# EasyEDA Pro project ProPrj_FRC ESP32 CAN DevKit Lite_2025-11-01.epro, board PCB1
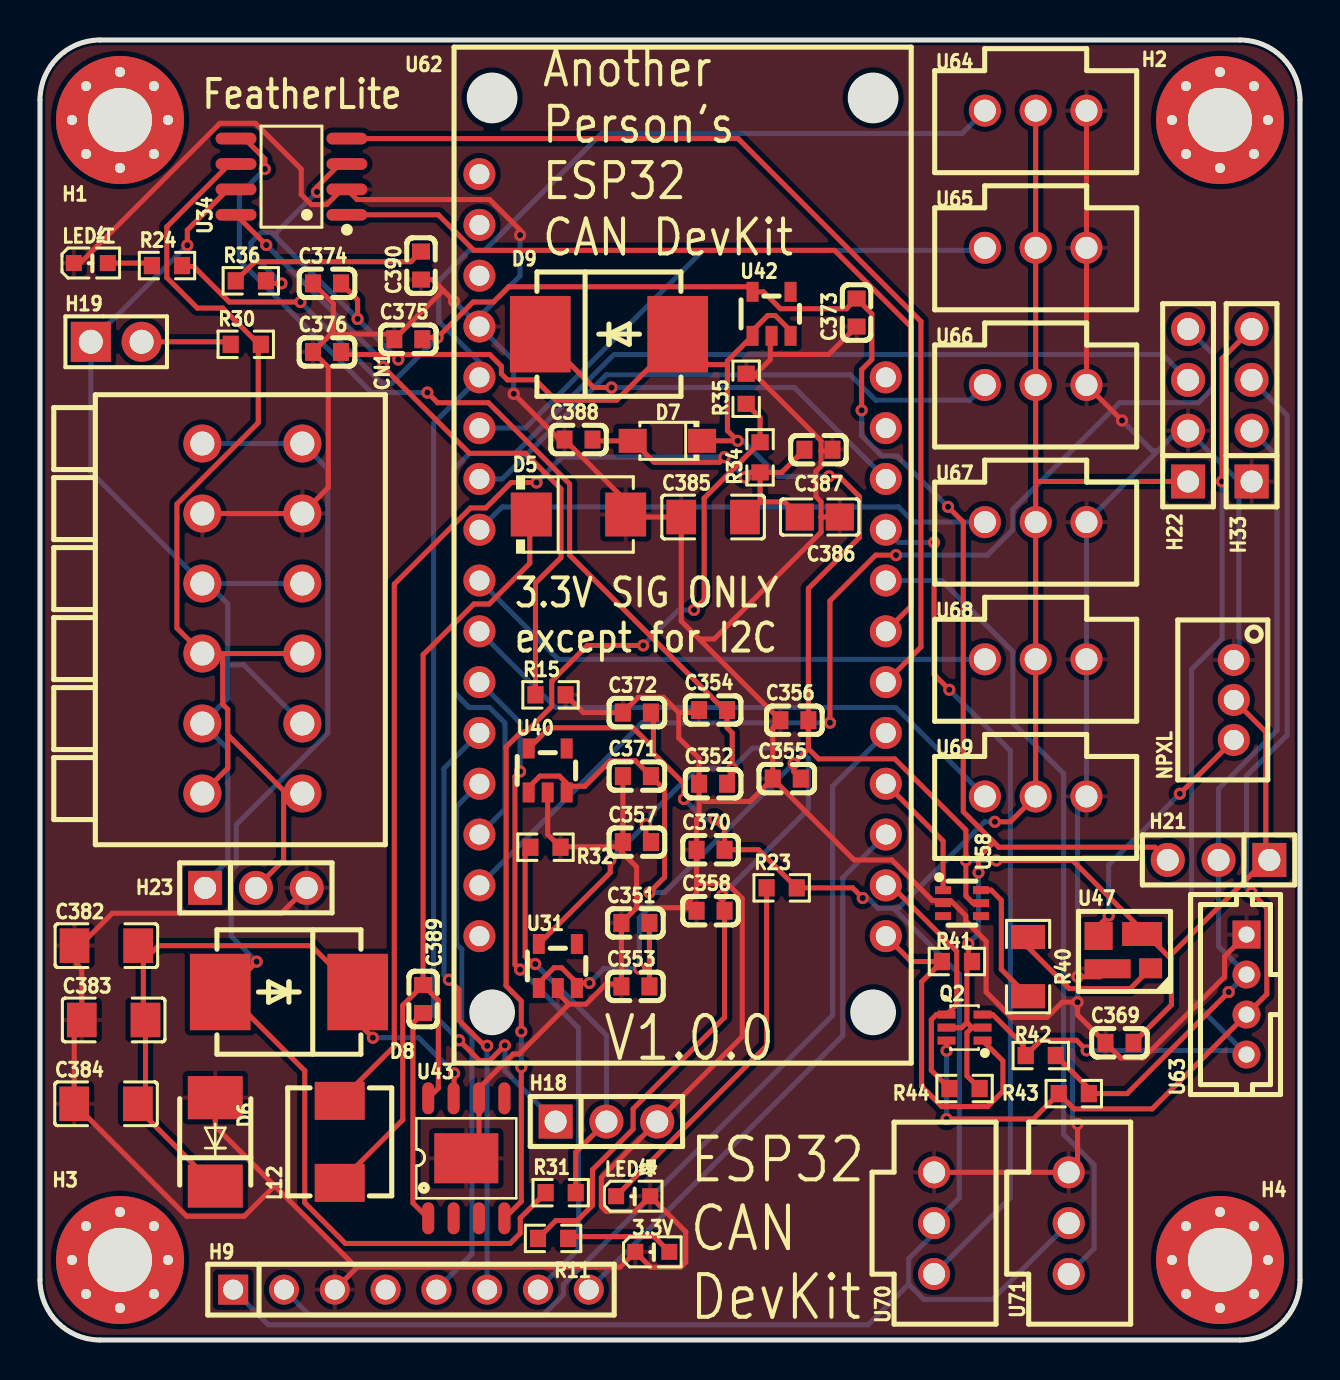
[diagram p1: board, top side]
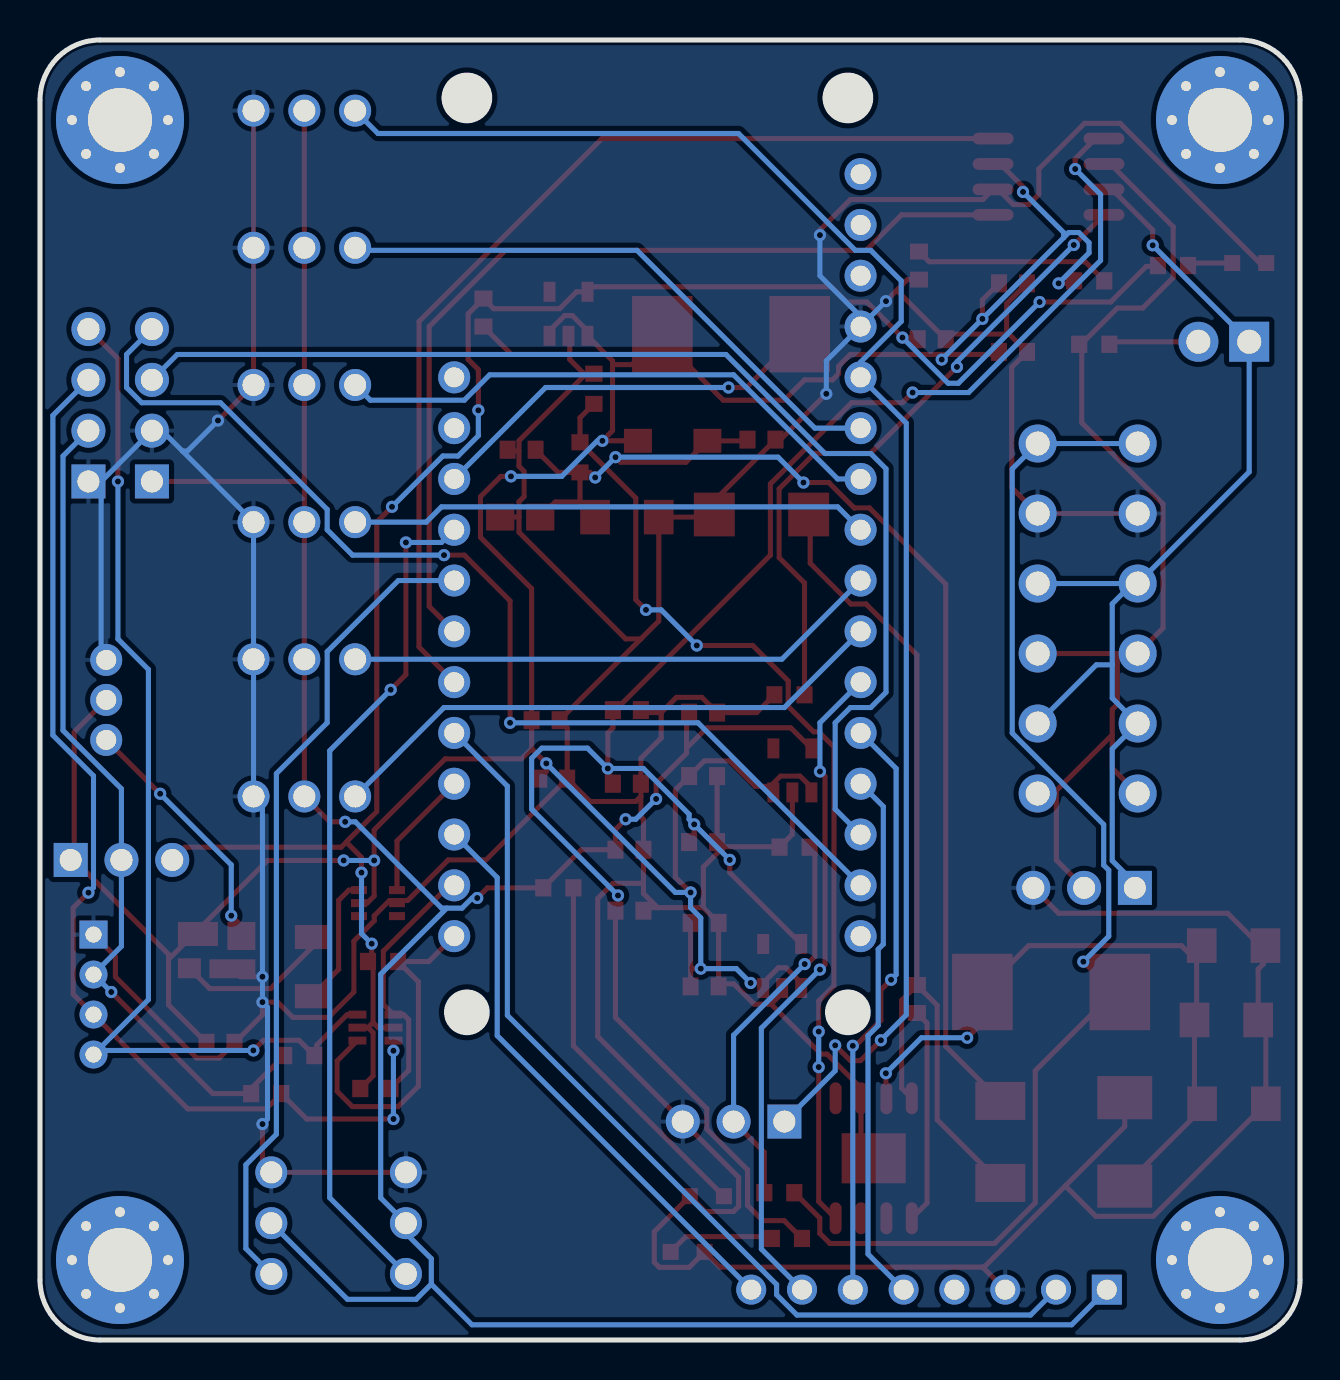
[diagram p2: board, bottom side, seen from below]

Outline 63 x 65 mm; copper layers: Top Layer, Bottom Layer. Coordinates in mm from the lower left corner of the outline.
Outline path: 0,62 0,3 arc(0.88,0.88) 3,0 60,0 arc(62.12,0.88) 63,3 63,62 arc(62.12,64.12) 60,65 3,65 arc(0.88,64.12) 0,62
Stack: Top Layer 0.035mm / Dielectric1 1.51mm FR4 er 4.5 / Bottom Layer 0.035mm

## Design rules (mm)
template: JLCPCB Capability(Two Layers Board)
spacing copperThickness1oz (default): track to track 0.102, other pairs 0.152 to 0.3
spacing copperThickness2oz: track to track 0.203, other pairs 0.152 to 0.3
track width copperThickness1oz (default): min 0.127, default 0.254, max 2.54
track width copperThickness2oz: min 0.203, default 0.254, max 2.54
differential pair differentialPair (default): width min 0.127, default 0.254, max 2.54; gap min 0.152, default 0.152
via viaSize (default): diameter min 0.5, default 0.61, max 10; hole min 0.3, default 0.305, max 6.3

## Placement (name value [footprint] x y rotation side)
3.3V  SZYY0603B  [LED0603-R-RD_BLUE]  30.61 4.44 0 top
C351  10uF  [C0603]  29.77 20.85 0 top
C352  10uF  [C0603]  33.66 27.81 0 top
C353  100nF  [C0603]  29.77 17.68 0 top
C354  100nF  [C0603]  33.66 31.5 0 top
C355  10uF  [C0603]  37.34 28.07 0 top
C356  100nF  [C0603]  37.72 30.99 0 top
C357  10uF  [C0603]  29.84 24.89 0 top
C358  100nF  [C0603]  33.53 21.46 0 top
C369  10uF  [C0603]  53.97 14.86 0 top
C370  10uF  [C0603]  33.53 24.51 0 top
C371  100nF  [C0603]  29.84 28.2 0 top
C372  100nF  [C0603]  29.84 31.37 0 top
C373  10uF  [C0603]  40.83 51.37 90 top
C374  100nF  [C0603]  14.35 52.83 0 top
C375  100nF  [C0603]  18.41 50.04 0 top
C376  10uF  [C0603]  14.35 49.4 0 top
C382  10uF  [C1206]  3.32 19.72 0 top
C383  22uF  [C1206]  3.68 16 0 top
C384  100nF  [C1206]  3.3 11.81 0 top
C385  47uF  [C1206]  33.66 41.15 0 top
C386  22uF  [C0805]  38.99 41.15 180 top
C387  10uF  [C0603]  38.92 44.51 180 top
C388  100nF  [C0603]  26.93 45.02 0 top
C389  100nF  [C0603]  19.16 17.05 270 top
C390  4.7uF  [C0603]  19.05 53.72 90 top
CN1  New_Library_2601-1106  [CONN-TH_2601-1106]  10.62 36.07 270 top
D5  SS54SMB  [SMB_L4.6-W3.6-LS5.3-RD]  26.92 41.28 0 top
D6  SMBJ28A  [SMB_L4.6-W3.6-LS5.3-L-FD]  8.76 9.91 270 top
D7  DSK34  [SOD-123FL_L2.7-W1.8-LS3.8-RD]  31.37 44.96 180 top
D8  MBRS540T3G  [SMC_L7.1-W6.2-LS8.1-RD]  12.45 17.4 180 top
D9  MBRS540T3G  [SMC_L7.1-W6.2-LS8.1-RD]  28.45 50.29 0 top
H1  Hole_Pad  [MountingHole:MountingHole_3.2mm_M3_Pad_Via]  4 61 0 top
H2  Hole_Pad  [MountingHole:MountingHole_3.2mm_M3_Pad_Via]  59 61 0 top
H3  Hole_Pad  [MountingHole:MountingHole_3.2mm_M3_Pad_Via]  4 4 0 top
H4  Hole_Pad  [MountingHole:MountingHole_3.2mm_M3_Pad_Via]  59 4 0 top
H9  PZ254V-11-08P  [HDR-TH_8P-P2.54-V-M]  18.55 2.52 0 top
H18  PZ254V-11-03P  [HDR-TH_3P-P2.54-V-M]  28.32 10.92 0 top
H19  PZ254V-11-02P  [HDR-TH_2P-P2.54-V-M]  3.81 49.91 0 top
H21  PZ254V-11-03P  [HDR-TH_3P-P2.54-V-M]  58.93 24 180 top
H22  PZ254V-11-04P  [HDR-TH_4P-P2.54-V-M]  57.4 46.74 90 top
H23  PZ254V-11-03P  [HDR-TH_3P-P2.54-V-M]  10.79 22.61 0 top
H33  PZ254V-11-04P  [HDR-TH_4P-P2.54-V-M]  60.58 46.74 90 top
L12  10uH  [IND-SMD_L5.4-W5.2_FXL0530]  14.99 9.91 90 top
LED红  3.3V  [LED0603-R-RD]  2.54 53.85 0 top
LED绿  XL-1608PGC-06  [LED0603-RD_GREEN]  29.72 7.24 0 top
NPXL  B3B-PH-K-S(LF)(SN)  [CONN-TH_B3B-PH-K-S]  59.69 32 90 top
Q2  BSS138BKS,115  [SOT-363_L2.0-W1.3-P0.65-LS2.1-BR]  46.23 15.62 0 top
R11  10kΩ  [R0603]  25.65 5.08 180 top
R15  0Ω  [R0603]  25.53 32.26 0 top
R23  10kΩ  [R0603]  37.08 22.61 0 top
R24  10kΩ  [R0603]  6.35 53.72 0 top
R30  120Ω  [R0603]  10.29 49.78 0 top
R31  82kΩ  [R0603]  26.03 7.37 0 top
R32  10kΩ  [R0603]  25.27 24.64 180 top
R34  10kΩ  [R0603]  36 44.13 90 top
R35  31.3kΩ  [R0603]  35.31 47.56 90 top
R36  470kΩ  [R0603]  10.54 52.96 0 top
R40  400Ω  [R1206]  49.4 18.67 270 top
R41  10kΩ  [R0603]  45.85 18.92 0 top
R42  10kΩ  [R0603]  50.04 14.22 0 top
R43  10kΩ  [R0603]  51.69 12.32 0 top
R44  10kΩ  [R0603]  46.23 12.57 0 top
U31  ME6211C30M5G-N  [SOT-23-5_L2.9-W1.6-P0.95-LS2.8-BL]  25.89 18.7 0 top
U34  TJA1051T/3/1J  [SOIC-8_L4.9-W3.9-P1.27-LS6.0-BL]  12.57 58.17 90 top
U40  ME6211C30M5G-N  [SOT-23-5_L2.9-W1.6-P0.95-LS2.8-BL]  25.38 28.48 0 top
U42  ME6211C30M5G-N  [SOT-23-5_L2.9-W1.6-P0.95-LS2.8-BL]  36.58 51.31 0 top
U43  TPS5450MDDAREP  [POWERPAD-SO-8_L4.9-W3.9-P1.27-LS6.0-BL-EP]  21.32 9.09 0 top
U47  SK6812MINI-C  [LED-SMD_4P-L3.5-W3.5-R-SK6812MINI]  54.23 19.43 0 top
U58  74HCT2G34GW,125  [SC-88-6_L2.0-W1.3-P0.65-LS2.1-BL]  46.1 21.84 270 top
U62  Feather MCU  [COMM-TH_L50.8-W22.9-P2.54-LS20.32]  32.13 39.24 270 top
U63  B4B-PH-K(LF)(SN)  [CONN-TH_B4B-PH-K-LF-SN]  60.32 17.27 90 top
U64  1719710003  [CONN-TH_3P-P2.54_171971-0003]  49.78 61.47 0 top
U65  1719710003  [CONN-TH_3P-P2.54_171971-0003]  49.78 54.61 0 top
U66  1719710003  [CONN-TH_3P-P2.54_171971-0003]  49.78 47.75 0 top
U67  1719710003  [CONN-TH_3P-P2.54_171971-0003]  49.78 40.89 0 top
U68  1719710003  [CONN-TH_3P-P2.54_171971-0003]  49.78 34.04 0 top
U69  1719710003  [CONN-TH_3P-P2.54_171971-0003]  49.78 27.18 0 top
U70  1719710003  [CONN-TH_3P-P2.54_171971-0003]  44.7 5.84 90 top
U71  1719710003  [CONN-TH_3P-P2.54_171971-0003]  51.44 5.84 90 top

## Footprints (pads in the part's own frame, mm; a bottom-side part is the same pattern mirrored in y, then rotated)
C0603
  rect 0.8x0.9 smd: 1(-0.7,0) 2(0.7,0)
C0805
  rect 1.41x1.35 smd: 1(-1,0) 2(1,0)
C1206
  rect 1.485x1.728 smd: 1(-1.593,0) 2(1.593,0)
COMM-TH_L50.8-W22.9-P2.54-LS20.32
  round 1.6 hole 1: 1(-19.05,-10.16) 2(-16.51,-10.16) 3(-13.97,-10.16) 4(-11.43,-10.16) 5(-8.89,-10.16) 6(-6.35,-10.16) 7(-3.81,-10.16) 8(-1.27,-10.16) 9(1.27,-10.16) 10(3.81,-10.16) 11(6.35,-10.16) 12(8.89,-10.16) 13(11.43,-10.16) 14(13.97,-10.16) 15(16.51,-10.16) 16(19.05,-10.16) 17(19.05,10.16) 18(16.51,10.16) 19(13.97,10.16) 20(11.43,10.16) 21(8.89,10.16) 22(6.35,10.16) 23(3.81,10.16) 24(1.27,10.16) 25(-1.27,10.16) 26(-3.81,10.16) 27(-6.35,10.16) 28(-8.89,10.16)
CONN-TH_3P-P2.54_171971-0003
  round 1.6 hole 1.1: 1(-2.54,0) 2(0,0) 3(2.54,0)
CONN-TH_2601-1106
  round 1.9 hole 1.2: 1(-8.75,2.5) 1(-8.75,-2.5) 2(-5.25,2.5) 2(-5.25,-2.5) 3(-1.75,2.5) 3(-1.75,-2.5) 4(1.75,2.5) 4(1.75,-2.5) 5(5.25,2.5) 5(5.25,-2.5) 6(8.75,2.5) 6(8.75,-2.5)
CONN-TH_B3B-PH-K-S
  round 1.6 hole 1: 1(2,0) 2(0,0) 3(-2,0)
CONN-TH_B4B-PH-K-LF-SN
  rect 1.4x1.4 hole 0.8: 1(3,0)
  round 1.4 hole 0.8: 2(1,0) 3(-1,0) 4(-3,0)
HDR-TH_2P-P2.54-V-M
  rect 2x2 hole 1.2: 1(-1.27,0)
  round 2 hole 1.2: 2(1.27,0)
HDR-TH_3P-P2.54-V-M
  rect 1.7x1.7 hole 1.1: 1(-2.54,0)
  round 1.7 hole 1.1: 2(0,0) 3(2.54,0)
HDR-TH_4P-P2.54-V-M
  rect 1.7x1.7 hole 1.1: 1(-3.81,0)
  round 1.7 hole 1.1: 2(-1.27,0) 3(1.27,0) 4(3.81,0)
HDR-TH_8P-P2.54-V-M
  rect 1.5x1.5 hole 1: 1(-8.89,0)
  round 1.5 hole 1: 2(-6.35,0) 3(-3.81,0) 4(-1.27,0) 5(1.27,0) 6(3.81,0) 7(6.35,0) 8(8.89,0)
IND-SMD_L5.4-W5.2_FXL0530
  rect 1.9x2.5 smd: 1(-2.05,0) 2(2.05,0)
LED0603-R-RD
  rect 0.8x0.8 smd: 1(0.851,0) 2(-0.851,0)
LED0603-R-RD_BLUE
  rect 0.8x0.8 smd: 1(0.862,-0.038) 2(-0.841,-0.038)
LED0603-RD_GREEN
  rect 0.8x0.8 smd: 1(0.791,-0.05) 2(-0.911,-0.05)
LED-SMD_4P-L3.5-W3.5-R-SK6812MINI
  rect 1.15x1 smd: 1(1.3,-0.845)
  rect 2x1.2 smd: 2(0.875,0.87)
  rect 1.4x1.4 smd: 3(-1.3,0.77)
  rect 2.3x0.95 smd: 4(-0.85,-0.87)
MountingHole:MountingHole_3.2mm_M3_Pad_Via
  round 0.8 hole 0.5: 1(-2.4,0) 1(-1.697,1.697) 1(-1.697,-1.697) 1(0,2.4) 1(0,-2.4) 1(1.697,1.697) 1(1.697,-1.697) 1(2.4,0)
  round 6.4 hole 3.2: 1(0,0)
POWERPAD-SO-8_L4.9-W3.9-P1.27-LS6.0-BL-EP
  oval 0.6x1.6 smd: 1(-1.905,-3) 2(-0.635,-3) 3(0.635,-3) 4(1.905,-3) 5(1.905,3) 6(0.635,3) 7(-0.635,3) 8(-1.905,3)
  rect 3.2x2.5 smd: 9(0,0)
R0603
  rect 0.806x0.864 smd: 1(-0.753,0) 2(0.753,0)
R1206
  rect 1.208x1.701 smd: 1(-1.479,0) 2(1.479,0)
SC-88-6_L2.0-W1.3-P0.65-LS2.1-BL
  rect 0.4x0.8 smd: 1(-0.65,-0.95) 2(0,-0.95) 3(0.65,-0.95) 4(0.65,0.95) 5(0,0.95) 6(-0.65,0.95)
SMB_L4.6-W3.6-LS5.3-L-FD
  rect 2.159x2.743 smd: 1(-2.21,0) 2(2.21,0)
SMB_L4.6-W3.6-LS5.3-RD
  rect 2.047x2.192 smd: 1(-2.361,0) 2(2.361,0)
SMC_L7.1-W6.2-LS8.1-RD
  rect 3.03x3.82 smd: 1(-3.435,0) 2(3.435,0)
SOD-123FL_L2.7-W1.8-LS3.8-RD
  rect 1.4x1.2 smd: 1(-1.735,0) 2(1.735,0)
SOIC-8_L4.9-W3.9-P1.27-LS6.0-BL
  oval 0.588x2.045 smd: 1(-1.905,-2.772) 2(-0.635,-2.772) 3(0.635,-2.772) 4(1.905,-2.772) 5(1.905,2.772) 6(0.635,2.772) 7(-0.635,2.772) 8(-1.905,2.772)
SOT-23-5_L2.9-W1.6-P0.95-LS2.8-BL
  rect 0.6x1 smd: 1(-0.95,-1.1) 2(0,-1.1) 3(0.95,-1.1) 4(0.95,1.1) 5(-0.95,1.1)
SOT-363_L2.0-W1.3-P0.65-LS2.1-BR
  rect 0.9x0.4 smd: 1(0.9,-0.65) 2(0.9,0) 3(0.9,0.65) 4(-0.9,0.65) 5(-0.9,0) 6(-0.9,-0.65)

## Nets
As in the schematic.

Pads without a net: H1 1; H2 1; H3 1; H4 1; H9 4; U31 4; U40 4; U42 4; U43 2 3 5; U58 3 4; U62 1 2 3 16 27 28

## Via types
v1: diameter 0.61, hole 0.305, Top Layer to Bottom Layer, 68 vias

## Routing (per net, layer and track width the routed paths; a pad name or vN(x,y) marks a point on that pad's centre or on a via; arc(x,y) is an arc through that point)
3V3: length 96.8
  Top Layer w0.254: v1(30.29,25.78) 30.29,25.15 C357.2 ; v1(34.1,22.23) 34.1,21.59 C358.2 34.23,16.13 29.66,11.56 29.66,10.54 27.62,8.51 27.62,6.73 26.86,5.97 25.79,5.97 R11.2 ; C352.2 34.35,28.07 34.61,28.32 34.61,30.35 34.35,30.61 34.35,31.37 ; U34.5 10.23,60.07 11.24,59.06 v1(11.24,58.55) ; v1(19.37,47.37) 19.88,46.86 22.42,46.86 26.48,42.8 26.48,39.24 34.35,31.37 ; 34.35,31.37 C354.2 ; v1(28.51,24) 28.51,23.37 24.94,19.8
  Bottom Layer w0.254: v1(28.51,24) v1(30.29,25.78) 30.54,26.04 30.54,26.29 32.83,28.58 v1(34.61,28.58) 35.62,29.59 37.91,29.59 38.42,29.08 38.42,26.54 v1(34.1,22.23) ; v1(11.24,58.55) 9.97,57.28 9.97,53.98 16.57,47.37 v1(19.37,47.37)
3V3_POWER: length 94.7
  Top Layer w0.254: 46.35,15.88 46.09,15.62 Q2.5 ; 46.35,15.88 46.35,18.67 R41.2 46.42,19.11 v1(46.42,19.81) ; 46.35,15.88 46.6,15.62 ; 46.6,15.62 46.35,15.37 46.35,13.21 R44.2 ; 46.6,15.62 Q2.2 ; H21.3 55.75,24.64 47.94,24.64 47.69,24.89 ; 47.69,24.89 46.16,26.42 46.16,40.9 v1(45.4,41.66) ; 47.69,24.89 46.92,24.13 v1(46.92,23.37) ; v1(41.08,46.48) 41.08,48.52 41.59,49.02 41.59,51.31 C373.2 40.32,51.56 37.02,51.56 36.18,52.41 U42.5 35.37,52.66 23.43,52.66 22.67,51.9 21.66,51.9 v1(19.88,50.12) 19.2,50.12 19.12,50.04 ; v1(13.02,51.9) 9.46,51.9 7.69,53.68 7.15,53.68 R24.2
  Bottom Layer w0.254: v1(19.88,50.12) 17.59,47.84 17.08,47.84 v1(13.02,51.9) ; v1(46.92,23.37) 46.92,20.32 v1(46.42,19.81) ; v1(41.08,46.48) 41.08,45.21 42.1,44.2 42.86,44.2 v1(45.4,41.66)
+5V: length 163.3
  Top Layer w0.254: 26.48,27.69 25.97,28.2 25,28.2 24.43,27.63 U40.1 ; 26.48,27.69 26.48,27.52 U40.3 ; 26.48,27.69 27.24,27.69 28.51,28.96 29.78,28.96 C371.2 31.23,27.51 31.23,23.14 v1(30.47,22.38) ; 17.91,49.28 22.49,49.28 23.07,48.69 23.07,48.31 23.37,48.01 24.77,48.01 25.79,46.99 28.84,46.99 31.88,50.04 D9.2 33.41,48.77 34.37,48.77 ; 17.91,49.28 v1(17.91,49.02) ; 17.91,49.28 15.18,49.28 C376.2 ; 34.37,48.77 34.37,48.95 U42.1 35.63,50.46 36.39,51.22 36.76,51.22 37.53,50.46 U42.3 ; 34.37,48.77 34.37,45.47 v1(34.88,44.96) 33.11,44.96 ; C374.2 15.88,52 v1(15.88,51.05) ; 56.57,19.03 55.3,20.3 55.05,20.3 54.93,20.42 54.93,20.67 51.63,23.98 v1(47.82,23.98) ; 56.57,19.03 56.57,19.28 61.29,24 ; 56.57,19.03 56.57,16.76 54.68,14.86 ; 30.47,18.57 v1(29.96,18.57) ; 30.47,18.57 C351.2 ; 30.47,18.57 C353.2 ; 61.29,24 61.29,30.4 NPXL.2 ; 61.29,24 H21.1 ; v1(27.47,17.85) 27.1,17.85 26.84,17.6 26.84,17.85 26.08,18.61 25.7,18.61 24.94,17.85 24.94,17.6 ; 38.42,29.56 38.42,37.58 40.98,40.13 40.98,42.17 39.96,43.18 v1(39.45,43.18) ; 38.42,29.56 v1(37.69,28.83) 37.69,28.42 C355.2 ; 38.42,29.56 38.93,29.06 42.74,29.06 46.29,25.5 v1(46.29,23.98) 46.29,22.2 46.65,21.84 U58.5 ; U34.3 14.99,58.8 13.85,57.66 v1(13.85,57.4) ; v1(12.07,52.83) 11.42,52.83 R36.2
  Bottom Layer w0.254: 11.82,55.12 v1(15.88,51.05) v1(17.91,49.02) ; 11.82,55.12 11.56,55.37 11.06,55.37 10.55,54.86 10.55,54.36 v1(12.07,52.83) ; 11.82,55.12 11.82,55.37 v1(13.85,57.4) ; v1(37.69,28.83) 31.23,22.38 v1(30.47,22.38) 30.47,21.62 29.96,21.11 v1(29.96,18.57) 28.18,18.57 v1(27.47,17.85) ; v1(39.45,43.18) 36.91,43.18 35.13,44.96 v1(34.88,44.96) ; v1(46.29,23.98) v1(47.82,23.98)
GND: length 385.4
  Top Layer w0.254: CN1.2 CN1.2 14.41,42.62 14.41,48.64 C376.1 14.54,50.29 14.67,50.29 ; 11.73,7.71 8.76,10.68 D6.1 ; 11.73,7.71 15.8,3.65 15.87,3.65 ; 11.73,7.71 10.21,6.19 7.34,6.19 C384.1 1.71,15.62 C383.1 2.09,18.54 1.84,18.8 1.84,19.56 ; U70.3 U71.3 51.88,8.82 v1(51.88,10.8) ; 29.83,21.62 32.12,21.62 ; 29.83,21.62 29.83,23.65 29.07,24.41 29.07,24.66 ; 29.83,21.62 C351.1 29.07,17.81 ; 32.12,21.62 32.83,22.33 32.83,22.83 ; 32.12,21.62 32.68,21.62 C358.1 ; 15.87,3.65 29,3.65 29.77,4.41 30.54,3.63 32.03,3.63 32.29,3.89 32.29,5.41 LED绿.1 29.75,6.43 28.32,6.43 28.07,6.68 28.07,8.13 H18.3 35.11,15.17 35.11,22.07 34.35,22.83 32.83,22.83 ; 15.87,3.65 H9.3 ; 29.07,17.81 28.31,17.81 27.29,16.79 26.45,16.79 ; 29.07,17.81 C353.1 ; LED红.2 2.01,53.85 9,60.83 10.77,60.83 13.06,58.55 13.06,57.28 13.57,56.77 14.33,56.77 15.09,57.53 15.35,57.53 15.85,57.02 22.48,57.02 24,55.5 v1(24,55.25) ; 45.02,21.97 U58.2 ; 45.02,21.97 45.53,21.97 46.29,21.21 46.29,20.96 47.31,19.94 47.31,17.4 48.58,16.13 50.35,16.13 51.12,16.89 v1(51.88,16.89) 51.88,16.26 C369.1 54.04,14.1 55.17,14.1 59.23,18.16 59.23,19.18 U63.1 ; 45.02,21.97 44.62,21.97 42.59,24 40.7,24 C355.1 ; 13.34,22.61 12.06,21.34 3.61,21.34 1.84,19.56 ; 32.96,35.05 C356.1 36.64,30.61 C355.1 ; 32.96,35.05 32.06,35.95 C385.1 29.41,41.15 D5.2 29.28,41.96 C388.1 25.97,45.02 v1(23.69,47.31) ; 32.96,35.05 33.72,35.05 39.05,40.39 39.05,41.15 ; 35.75,48.26 36.51,49.02 36.51,49.28 ; 35.75,48.26 35.36,48.26 R35.2 ; 35.75,48.26 39.05,44.96 39.05,44.45 ; v1(20.7,51.94) 20.19,52.45 ; 20.19,52.45 19.62,53.02 C390.1 ; 20.19,52.45 20.13,52.45 C375.1 17.46,50.29 14.67,50.29 ; 39.05,41.15 C386.1 ; 39.05,41.15 39.05,41.91 38.8,42.17 38.8,43.44 39.05,43.69 39.05,44.45 ; 39.05,44.45 39.56,44.45 C387.1 ; 36.51,49.28 39.43,49.28 C373.1 ; 36.51,49.28 36.51,50.14 U42.2 ; 26.45,16.79 23.95,14.3 23.65,14.3 21.95,12.59 U43.6 21.95,9.72 U43.9 ; 26.45,16.79 25.89,17.34 25.89,17.6 ; 31.94,31.37 32.83,31.37 C354.1 ; 31.94,31.37 31.94,30.1 32.96,29.08 C352.1 32.96,27.18 ; 31.94,31.37 31.18,32.13 29.91,32.13 C372.1 27.17,31.37 R15.2 ; C374.1 14.67,51.82 14.67,50.29 ; C371.1 C357.1 29.07,24.66 ; 29.07,24.66 26.05,24.66 R32.1 25.38,25.28 U40.2 ; C355.1 35.5,26.93 33.21,26.93 32.96,27.18 ; 32.96,27.18 32.96,26.16 32.83,26.04 C370.1 32.83,22.83 ; 1.84,19.56 C382.1 ; v1(51.88,18.16) 52.98,18.16 U47.4 ; v1(54.1,45.97) U66.3 U65.3 U64.3
  Bottom Layer w0.254: v1(23.69,47.31) 23.69,48.96 U62.4 21.72,50.93 ; v1(24,55.25) 24,53.21 21.72,50.93 ; 59.94,42.93 59.94,34.26 NPXL.1 ; 59.94,42.93 H33.1 ; 59.94,42.93 H22.2 56.9,45.47 55.88,44.45 ; 55.88,44.45 U67.3 U68.3 U69.3 51.88,26.73 v1(51.88,18.16) v1(51.88,16.89) 51.62,16.64 51.62,11.05 v1(51.88,10.8) ; 55.88,44.45 55.63,44.45 v1(54.1,45.97) ; 21.72,50.93 v1(20.7,51.94)
VCC: length 63
  Top Layer w0.254: 9.31,17.39 13.24,13.46 13.24,6.86 15.27,4.83 23.5,4.83 24.01,5.33 24.01,6.1 R31.1 ; 9.31,17.39 v1(10.83,18.92) ; 9.31,17.39 D8.2
  Bottom Layer w0.254: CN1.1 CN1.1 14.39,43.55 14.39,30.35 9.82,25.77 9.82,23.74 9.56,23.49 9.56,20.19 v1(10.83,18.92)
3.3_SENSOR: length 143.2
  Top Layer w0.254: 30.67,29.59 29.66,30.61 25.46,30.61 U40.5 ; 30.67,29.59 30.67,29.34 32.2,27.81 v1(32.2,27.05) ; 30.67,29.59 30.67,31.24 C372.2 ; 49.78,42.93 H22.1 ; 49.78,42.93 U67.2 U68.2 U69.2 48.52,25.91 v1(47.74,25.91) ; 49.78,42.93 U66.2 U65.2 U64.2 ; v1(33.72,26.04) 34.23,25.53 C370.2 35.93,24.51 37.84,22.61 40.63,22.61 v1(41.14,22.1)
  Bottom Layer w0.254: 42.66,21.59 45.97,18.29 45.97,7.1 U70.2 44.7,5.33 43.43,4.06 43.43,2.79 ; 42.66,21.59 41.9,21.59 41.39,22.1 v1(41.14,22.1) ; 42.66,21.59 42.92,21.59 47.24,25.91 v1(47.74,25.91) ; U71.2 47.62,2.03 44.2,2.03 43.43,2.79 ; 43.43,2.79 41.4,0.76 11.42,0.76 H9.1 ; v1(32.2,27.05) 33.21,26.04 v1(33.72,26.04)
A0: length 79
  Top Layer w0.254: v1(20.96,14.99) 21.97,13.97 22.48,13.97 v1(23.24,14.73)
  Bottom Layer w0.254: U64.1 46.1,60.33 28.07,60.33 22.23,54.48 21.46,54.48 19.94,52.96 19.94,50.93 21.97,48.89 U62.5 19.69,45.85 19.69,16.26 v1(20.96,14.99) ; v1(23.24,14.73) 23.24,13.46 H18.1
A1: length 29
  Bottom Layer w0.254: U62.6 24.26,45.59 33.15,54.48 47.12,54.48 U65.1
A2: length 28.3
  Bottom Layer w0.254: U66.1 46.48,46.99 41.78,46.99 40.51,48.26 28.32,48.26 23.11,43.05 U62.7
A3: length 26.1
  Bottom Layer w0.254: U67.1 43.69,40.89 42.93,41.66 23.11,41.66 U62.8
A4: length 26.9
  Bottom Layer w0.254: U62.9 25.91,34.04 U68.1
A5: length 28.7
  Bottom Layer w0.254: U62.10 25.78,31.62 42.8,31.62 U69.1
ADC: length 19.8
  Top Layer w0.254: R32.2 24.26,24.38 24.26,19.18 24.64,18.8 v1(24.76,18.8) ; H18.2 26.79,9.39 R31.2
  Bottom Layer w0.254: v1(24.76,18.8) 28.32,15.24 H18.2
CAN_H: length 52.4
  Top Layer w0.254: 9.8,57.53 9.4,57.53 7.37,55.5 v1(7.37,54.74)
  Bottom Layer w0.254: 8.37,37.82 CN1.3 ; 8.37,37.82 9.39,36.81 9.39,33.76 ; 8.37,37.82 CN1.3 2.54,43.4 H19.1 v1(7.37,54.74) ; 9.39,33.76 9.39,32.09 CN1.5 9.39,29.55 9.39,23.97 8.25,22.83 H23.1 ; 9.39,33.76 10.18,33.76 CN1.5
CAN_L: length 54.1
  Top Layer w0.254: 9.13,34.32 CN1.4 ; 9.13,34.32 9.13,31.78 9.39,31.53 9.39,30.26 ; 9.13,34.32 CN1.4 6.85,35.59 6.85,41.8 10.91,45.86 10.91,49.66 ; 9.39,30.26 9.39,28.59 CN1.6 ; 9.39,30.26 12.18,27.47 ; 12.18,27.47 12.98,27.47 CN1.6 ; 12.18,27.47 12.18,23.99 H23.2 ; 10.91,49.66 10.91,49.82 9.13,51.6 7.86,51.6 6.34,53.12 6.34,55.66 9.39,58.71 9.71,58.71 U34.6 ; 10.91,49.66 R30.2
CAN_RX: length 51.3
  Top Layer w0.254: U62.22 44.05,34.65 44.05,50.93 34.9,60.07 U34.4
CAN_TX: length 46.3
  Top Layer w0.254: U34.1 19.92,56.26 21.7,54.48 39.73,54.48 43.54,50.67 43.54,36.68 U62.23
FB: length 49.2
  Top Layer w0.254: v1(24.06,13.64) 24.06,6.93 U43.4 ; 35.31,46.81 36,46.11 R34.2 33.21,42.09 33.21,37.01 v1(32.7,36.5) ; v1(24.06,15.42) 24.06,16.95 23.3,17.71 23.3,29.65 24.06,30.41 24.32,30.41 25.59,31.68 25.59,32.95 27.37,34.73 v1(30.16,34.73)
  Bottom Layer w0.254: v1(30.16,34.73) 31.94,36.5 v1(32.7,36.5) ; v1(24.06,15.42) v1(24.06,13.64)
IO_A: length 42.4
  Top Layer w0.254: v1(45.47,32.51) 44.7,33.27 v1(44.7,39.88)
  Bottom Layer w0.254: v1(45.47,32.51) 48.51,29.46 48.51,7.11 U70.1 ; v1(44.7,39.88) 42.93,39.88 U62.25
IO_B: length 41.1
  Bottom Layer w0.254: U62.24 45.09,37.97 48.64,34.42 48.64,30.86 51.18,28.32 51.18,10.29 52.71,8.76 52.71,4.57 U71.1
IO_PWR: length 42.5
  Top Layer w0.254: v1(59.44,17.4) 54.36,12.32 R43.2 52.44,12.57 R42.2
  Bottom Layer w0.254: H33.2 61.85,44.2 61.85,30.48 58.93,27.56 H21.2 58.93,19.69 60.2,18.42 ; v1(59.44,17.4) 60.2,18.16 60.2,18.42 ; 60.2,18.42 U63.2
MISO: length 26.8
  Bottom Layer w0.254: U62.13 20.84,26.68 20.84,19.79 21.09,19.54 21.09,15.73 21.6,15.22 21.6,4.3 H9.5
MOSI: length 29.5
  Top Layer w0.254: v1(22.36,14.71) 22.22,14.71 20.96,15.98 20.96,17.5 v1(20.45,18.01)
  Bottom Layer w0.254: U62.12 20.19,28.58 20.19,18.27 v1(20.45,18.01) ; H9.6 v1(22.36,14.71)
NPXL: length 6.5
  Top Layer w0.254: U58.1 45.15,24.95 U62.20
RFID0_SS: length 28.9
  Bottom Layer w0.254: U62.19 40.14,23.12 40.14,15.22 H9.8
RFID_RST: length 49.7
  Bottom Layer w0.254: H9.2 13.47,1.25 25.15,1.25 26.17,2.26 26.17,2.77 39.63,16.23 39.63,27.69 U62.21
RX: length 60.1
  Bottom Layer w0.254: U62.14 23.24,26.54 23.24,30.86 22.48,31.62 21.46,31.62 20.7,32.39 20.7,43.56 21.46,44.32 23.75,44.32 28.7,49.28 56.13,49.28 H22.3
SCK: length 33.5
  Top Layer w0.254: v1(24,18.52) 23.75,18.77 23.75,28.17 v1(24,28.43)
  Bottom Layer w0.254: v1(24,28.43) 24,30.86 U62.11 ; v1(24,18.52) 26.93,15.59 26.93,4.55 H9.7
SCL: length 53.3
  Top Layer w0.254: Q2.3 47.64,16.27 49.16,14.75 49.16,14.35 R42.1 50.05,14.99 51.82,14.99 v1(52.33,14.48) ; v1(59.1,42.93) 59.1,49.07 H33.4
  Bottom Layer w0.254: v1(59.1,42.93) 59.1,35.05 57.58,33.53 57.58,17.02 60.12,14.48 ; 60.12,14.48 U63.4 ; 60.12,14.48 v1(52.33,14.48)
SCL_3V: length 13
  Top Layer w0.254: R44.1 44.57,13.48 44.57,16.02 44.82,16.27 Q2.4 45.84,16.78 45.84,19.44 42.54,22.73 U62.18
SDA: length 55.9
  Top Layer w0.254: v1(60.58,22.37) 61.34,21.61 61.34,17.29 U63.3 55.61,11.56 51.7,11.56 R43.1 49.67,11.05 v1(45.33,11.05) ; 45.33,14.97 v1(45.33,14.46)
  Bottom Layer w0.254: v1(60.58,22.37) 60.32,22.62 60.32,28.21 62.36,30.24 62.36,46.23 H33.3 ; v1(45.33,14.46) v1(45.33,11.05)
SDA_3V: length 17.7
  Top Layer w0.254: U62.17 43.56,18.92 R41.1 44.08,17.91 44.08,12.69 45.1,11.67 47.38,11.67 48.14,12.43 48.14,13.95 47.13,14.97
TX: length 54.6
  Top Layer w0.254: v1(39.5,30.86) 39.5,36.96 41.78,39.24 v1(42.8,39.24)
  Bottom Layer w0.254: v1(39.5,30.86) 30.1,30.86 U62.15 ; v1(42.8,39.24) 47.37,39.24 48.64,40.51 48.64,41.53 53.97,46.86 57.91,46.86 58.67,47.62 58.67,49.28 H22.4
$1N3538: length 5.4
  Top Layer w0.254: 31.47,4.41 30.71,5.17 26.5,5.17 R11.1
$1N6214: length 32.9
  Top Layer w0.254: R15.1 24.77,37.85 26.04,39.12 26.04,42.56 24.27,44.34 21.47,44.34 v1(17.15,48.65) ; v1(11.31,54.75) U34.8
  Bottom Layer w0.254: v1(17.15,48.65) 17.15,48.91 v1(11.31,54.75)
$1N6447: length 4.5
  Top Layer w0.254: R30.1 9.41,49.91 H19.2
$1N10830: length 18.5
  Top Layer w0.254: LED绿.2 36.33,14.71 R23.1
$1N11549: length 2.3
  Top Layer w0.254: LED红.1 5.47,53.85 R24.1
$1N13604: length 34.6
  Top Layer w0.254: v1(16.64,15.11) 15.88,15.88 D8.1 13.56,19.72 5.93,19.72 5.17,18.96 ; 5.17,18.96 5.17,16.11 C383.2 5.28,12.19 C384.2 4.89,11.56 D6.2 ; 5.17,18.96 5.17,19.46 C382.2 ; v1(20.71,13.33) 20.71,12.11 U43.7
  Bottom Layer w0.254: v1(20.71,13.33) 18.93,15.11 v1(16.64,15.11)
$1N13650: length 44
  Top Layer w0.254: U43.8 19.92,12.59 19.92,16.99 C389.1 ; D5.1 24.49,41.2 24.49,38.83 22.46,36.8 21.69,36.8 19.16,34.26 C389.1 ; C389.1 18.14,16.73 18.14,11.01 L12.1
$1N13751: length 63.1
  Top Layer w0.254: R34.1 37.09,43.38 C387.2 ; R34.1 36,41.9 ; R34.1 35.49,43.38 v1(35.24,43.13) ; 36,41.9 37.23,41.9 C386.2 ; 36,41.9 C385.2 ; v1(34.22,44.14) 33.97,43.89 30.7,43.89 D7.2 27.69,44.96 C388.2 ; L12.2 17.71,14.68 17.71,37.79 21.52,41.6 22.29,41.6 23.56,42.87 v1(24.83,42.87)
  Bottom Layer w0.254: v1(24.83,42.87) 26.1,44.14 v1(34.22,44.14) v1(35.24,43.13)
$1N13789: length 10.8
  Top Layer w0.254: C389.2 18.65,15.84 18.65,6.85 U43.1
$1N38886: length 9.9
  Top Layer w0.254: R36.1 10.74,53.91 18.54,53.91 C390.2
$1N70923: length 7.9
  Top Layer w0.254: R40.1 49.4,19.63 51.47,17.57 54.51,17.57 55.53,18.59
$1N109686: length 12.6
  Top Layer w0.254: v1(53.44,21.22) 52.93,20.71 U47.3 ; v1(56.99,27.31) NPXL.3
  Bottom Layer w0.254: v1(53.44,21.22) 53.44,23.76 v1(56.99,27.31)
$1N109877: length 6.6
  Top Layer w0.254: R40.2 48.07,18.53 48.07,21.99 47.56,22.49 U58.6
$1N138044: length 20.3
  Top Layer w0.254: D9.1 27.68,47.62 v1(28.57,47.62)
  Bottom Layer w0.254: v1(28.57,47.62) 37.72,47.62 U62.26

## Copper pours and planes (outline as drawn; the poured copper is in the pictures)
GND on Top Layer: -4.7,68.71 70.61,68.71 70.61,-7.49 -4.7,-7.49
GND on Bottom Layer: -5.59,66.42 75.18,66.42 75.18,-11.18 -5.59,-11.18

## Text on the board
Top Silkscreen Layer: 3.3V SIG ONLY / except for I2C | FeatherLite | Another / Person's / ESP32 / CAN DevKit | V1.0.0 | ESP32 / CAN / DevKit
